# EasyEDA schematic 16 Inputs Card schematic.json
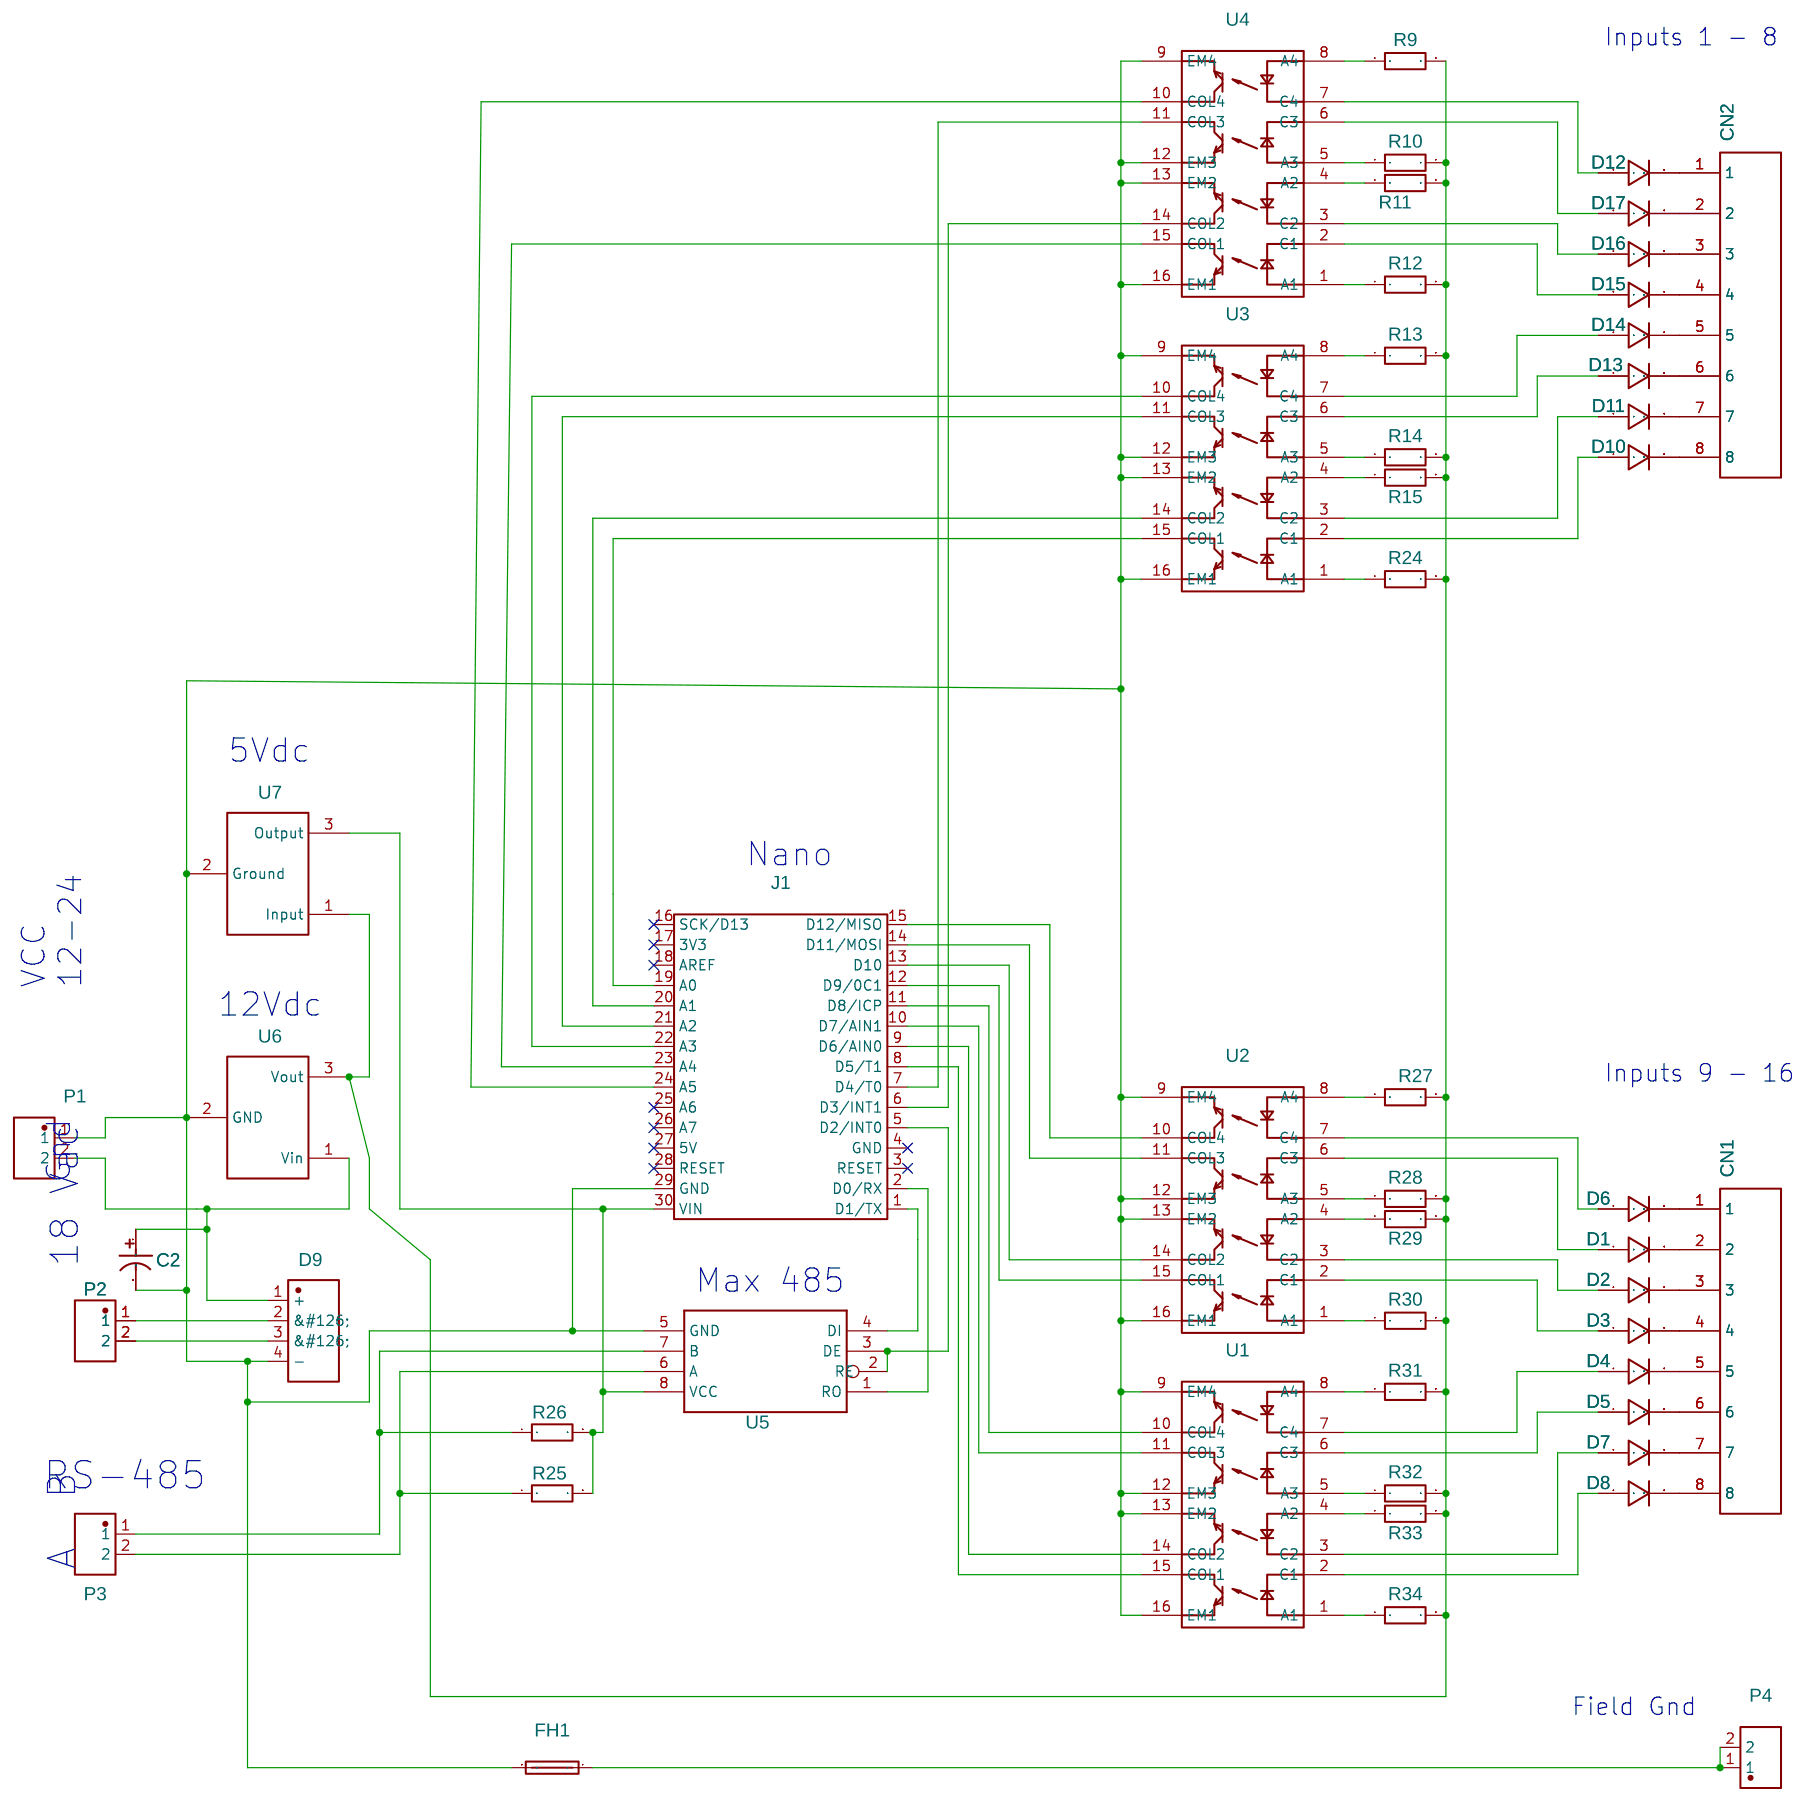
[diagram p0: schematic sheet]

## Parts
C2  470uF  [CAP-TH_BD16.0-P7.50-D1.2-FD]
CN1  WJ25C-B-7.62-8P-13-00A  [WJ25C-B-7.62-8P]
CN2  WJ25C-B-7.62-8P-13-00A  [WJ25C-B-7.62-8P]
D1  1N4001  [DO-41]
D2  1N4001  [DO-41]
D3  1N4001  [DO-41]
D4  1N4001  [DO-41]
D5  1N4001  [DO-41]
D6  1N4001  [DO-41]
D7  1N4001  [DO-41]
D8  1N4001  [DO-41]
D9  D50SB100  [DIO-BG-TH_DXXSBXX]
D10  1N4001  [DO-41]
D11  1N4001  [DO-41]
D12  1N4001  [DO-41]
D13  1N4001  [DO-41]
D14  1N4001  [DO-41]
D15  1N4001  [DO-41]
D16  1N4001  [DO-41]
D17  1N4001  [DO-41]
FH1  64600001003  [FUSE-2P-25.8X9.0]
J1  Arduino_Nano_Header  [DIP-30_L43.18-W15.24-ARDUINONANO]
P1  WJ25C-B-2P  [CONN-TH_2P-P7.62_WJ25C-B-7.62-2P]
P2  WJ25C-B-2P  [CONN-TH_2P-P7.62_WJ25C-B-7.62-2P]
P3  WJ25C-B-2P  [CONN-TH_2P-P7.62_WJ25C-B-7.62-2P]
P4  WJ25C-B-2P  [CONN-TH_2P-P7.62_WJ25C-B-7.62-2P]
R9  220  [RES-TH_BD2.2-L6.5-P10.50-D0.6]
R10  220  [RES-TH_BD2.2-L6.5-P10.50-D0.6]
R11  220  [RES-TH_BD2.2-L6.5-P10.50-D0.6]
R12  220  [RES-TH_BD2.2-L6.5-P10.50-D0.6]
R13  220  [RES-TH_BD2.2-L6.5-P10.50-D0.6]
R14  220  [RES-TH_BD2.2-L6.5-P10.50-D0.6]
R15  220  [RES-TH_BD2.2-L6.5-P10.50-D0.6]
R24  220  [RES-TH_BD2.2-L6.5-P10.50-D0.6]
R25  10K  [AXIAL-0.4]
R26  10K  [AXIAL-0.4]
R27  220  [RES-TH_BD2.2-L6.5-P10.50-D0.6]
R28  220  [RES-TH_BD2.2-L6.5-P10.50-D0.6]
R29  220  [RES-TH_BD2.2-L6.5-P10.50-D0.6]
R30  220  [RES-TH_BD2.2-L6.5-P10.50-D0.6]
R31  220  [RES-TH_BD2.2-L6.5-P10.50-D0.6]
R32  220  [RES-TH_BD2.2-L6.5-P10.50-D0.6]
R33  220  [RES-TH_BD2.2-L6.5-P10.50-D0.6]
R34  220  [RES-TH_BD2.2-L6.5-P10.50-D0.6]
U1  ILQ2  [DIP-16_L19.8-W6.5-P2.54-LS7.6-BL]
U2  ILQ2  [DIP-16_L19.8-W6.5-P2.54-LS7.6-BL]
U3  ILQ2  [DIP-16_L19.8-W6.5-P2.54-LS7.6-BL]
U4  ILQ2  [DIP-16_L19.8-W6.5-P2.54-LS7.6-BL]
U5  MAX485DIL  [DIP8]
U6  CJ7812  [TO-220-3_L10.0-W4.5-P2.54-L]
U7  MC7805BTG  [TO-220-3_L10.0-W4.5-P2.54-L]

## Library data of the parts
C2 = 470uF 100V 16*25: Supplier: LCSC; Manufacturer: ValuePro; Supplier Part: C72551
CN1 CN2 = -: Supplier: LCSC; Manufacturer: ReliaPro; image: //image.lceda.cn/szlcsc/C49492.jpg; Supplier Part: C49492
D1-D8 D10-D17 = -: Supplier Part: C169150; Supplier: LCSC; Manufacturer: DIOFIT; Contributor: LCSC
D9 = -: Supplier: LCSC; Supplier Part: C411148; Manufacturer: Leshan Radio; Contributor: LCSC
FH1 = -: Supplier: LCSC; Supplier Part: C206887; Manufacturer: Littelfuse; Contributor: LCSC
P1-P4 = -: Supplier: LCSC; Manufacturer: ReliaPro; image: //image.lceda.cn/szlcsc/C8422.jpg; Supplier Part: C8422
R9-R15 R24 R27-R34 = CFR0W4J0221A50: Supplier: LCSC; Manufacturer: UniOhm; Supplier Part: C61289
R25 R26 = CFR0W4J0103A50: Supplier: LCSC; Manufacturer: UniOhm; Supplier Part: C61299
U1-U4 = ILQ2: Supplier: LCSC; Manufacturer: VISHAY; Contributor: LCSC; Supplier Part: C145338
U5 = -: RS-485 transceiver; Contributor: SparkFun
U6 = -: Supplier: LCSC; Manufacturer: CJ; image: //image.lceda.cn/szlcsc/C77894.jpg; Supplier Part: C77894
U7 = -: Supplier: LCSC; Manufacturer: ON; image: //image.lceda.cn/szlcsc/C45385.jpg; Supplier Part: C45385

## Nets
Net-(C2-1): C2.1 D9.1(+) P1.2 U6.1(Vin)
Net-(C2-2): C2.2 D9.4(-) FH1.2 J1.29(GND) P1.1 U1.9(EM4) U1.12(EM3) U1.13(EM2) U1.16(EM1) U2.9(EM4) U2.12(EM3) U2.13(EM2) U2.16(EM1) U3.9(EM4) U3.12(EM3) U3.13(EM2) U3.16(EM1) U4.9(EM4) U4.12(EM3) U4.13(EM2) U4.16(EM1) U5.5(GND) U6.2(GND) U7.2(Ground)
Net-(CN1-1): CN1.1 D6.2
Net-(CN1-2): CN1.2 D1.2
Net-(CN1-3): CN1.3 D2.2
Net-(CN1-4): CN1.4 D3.2
Net-(CN1-5): CN1.5 D4.2
Net-(CN1-6): CN1.6 D5.2
Net-(CN1-7): CN1.7 D7.2
Net-(CN1-8): CN1.8 D8.2
Net-(CN2-1): CN2.1 D12.2
Net-(CN2-2): CN2.2 D17.2
Net-(CN2-3): CN2.3 D16.2
Net-(CN2-4): CN2.4 D15.2
Net-(CN2-5): CN2.5 D14.2
Net-(CN2-6): CN2.6 D13.2
Net-(CN2-7): CN2.7 D11.2
Net-(CN2-8): CN2.8 D10.2
Net-(D1-1): D1.1 U2.6(C3)
Net-(D2-1): D2.1 U2.3(C2)
Net-(D3-1): D3.1 U2.2(C1)
Net-(D4-1): D4.1 U1.7(C4)
Net-(D5-1): D5.1 U1.6(C3)
Net-(D6-1): D6.1 U2.7(C4)
Net-(D7-1): D7.1 U1.3(C2)
Net-(D8-1): D8.1 U1.2(C1)
Net-(D9-2): D9.2(&#126;) P2.1
Net-(D9-3): D9.3(&#126;) P2.2
Net-(D10-1): D10.1 U3.2(C1)
Net-(D11-1): D11.1 U3.3(C2)
Net-(D12-1): D12.1 U4.7(C4)
Net-(D13-1): D13.1 U3.6(C3)
Net-(D14-1): D14.1 U3.7(C4)
Net-(D15-1): D15.1 U4.2(C1)
Net-(D16-1): D16.1 U4.3(C2)
Net-(D17-1): D17.1 U4.6(C3)
Net-(FH1-1): FH1.1 P4.1 P4.2
Net-(J1-1): J1.1(D1/TX) U5.4(DI)
Net-(J1-2): J1.2(D0/RX) U5.1(RO)
Net-(J1-5): J1.5(D2/INT0) U5.2(RE) U5.3(DE)
Net-(J1-6): J1.6(D3/INT1) U4.14(COL2)
Net-(J1-7): J1.7(D4/T0) U4.11(COL3)
Net-(J1-8): J1.8(D5/T1) U1.15(COL1)
Net-(J1-9): J1.9(D6/AIN0) U1.14(COL2)
Net-(J1-10): J1.10(D7/AIN1) U1.11(COL3)
Net-(J1-11): J1.11(D8/ICP) U1.10(COL4)
Net-(J1-12): J1.12(D9/0C1) U2.15(COL1)
Net-(J1-13): J1.13(D10) U2.14(COL2)
Net-(J1-14): J1.14(D11/MOSI) U2.11(COL3)
Net-(J1-15): J1.15(D12/MISO) U2.10(COL4)
Net-(J1-19): J1.19(A0) U3.15(COL1)
Net-(J1-20): J1.20(A1) U3.14(COL2)
Net-(J1-21): J1.21(A2) U3.11(COL3)
Net-(J1-22): J1.22(A3) U3.10(COL4)
Net-(J1-23): J1.23(A4) U4.15(COL1)
Net-(J1-24): J1.24(A5) U4.10(COL4)
Net-(J1-30): J1.30(VIN) R25.2 R26.2 U5.8(VCC) U7.3(Output)
Net-(P3-1): P3.1 R26.1 U5.7(B)
Net-(P3-2): P3.2 R25.1 U5.6(A)
Net-(R9-1): R9.1 U4.8(A4)
Net-(R9-2): R9.2 R10.2 R11.2 R12.2 R13.2 R14.2 R15.2 R24.2 R27.2 R28.2 R29.2 R30.2 R31.2 R32.2 R33.2 R34.2 U6.3(Vout) U7.1(Input)
Net-(R10-1): R10.1 U4.5(A3)
Net-(R11-1): R11.1 U4.4(A2)
Net-(R12-1): R12.1 U4.1(A1)
Net-(R13-1): R13.1 U3.8(A4)
Net-(R14-1): R14.1 U3.5(A3)
Net-(R15-1): R15.1 U3.4(A2)
Net-(R24-1): R24.1 U3.1(A1)
Net-(R27-1): R27.1 U2.8(A4)
Net-(R28-1): R28.1 U2.5(A3)
Net-(R29-1): R29.1 U2.4(A2)
Net-(R30-1): R30.1 U2.1(A1)
Net-(R31-1): R31.1 U1.8(A4)
Net-(R32-1): R32.1 U1.5(A3)
Net-(R33-1): R33.1 U1.4(A2)
Net-(R34-1): R34.1 U1.1(A1)

Not connected (* = marked no-connect by the designer): J1 3(RESET)* 4(GND)* 16(SCK/D13)* 17(3V3)* 18(AREF)* 25(A6)* 26(A7)* 27(5V)* 28(RESET)*

## Notes on the sheet
- Inputs 1 - 8
- 5Vdc
- Nano
- VCC
  12-24
- 12Vdc
- Inputs 9 - 16
- Gnd
- 18 Vac
- Max 485
- RS-485
- B
- A
- Field Gnd
